# EAGLE schematic OBI_SlaveBoard_rev4 (EAGLE 7.2.0)
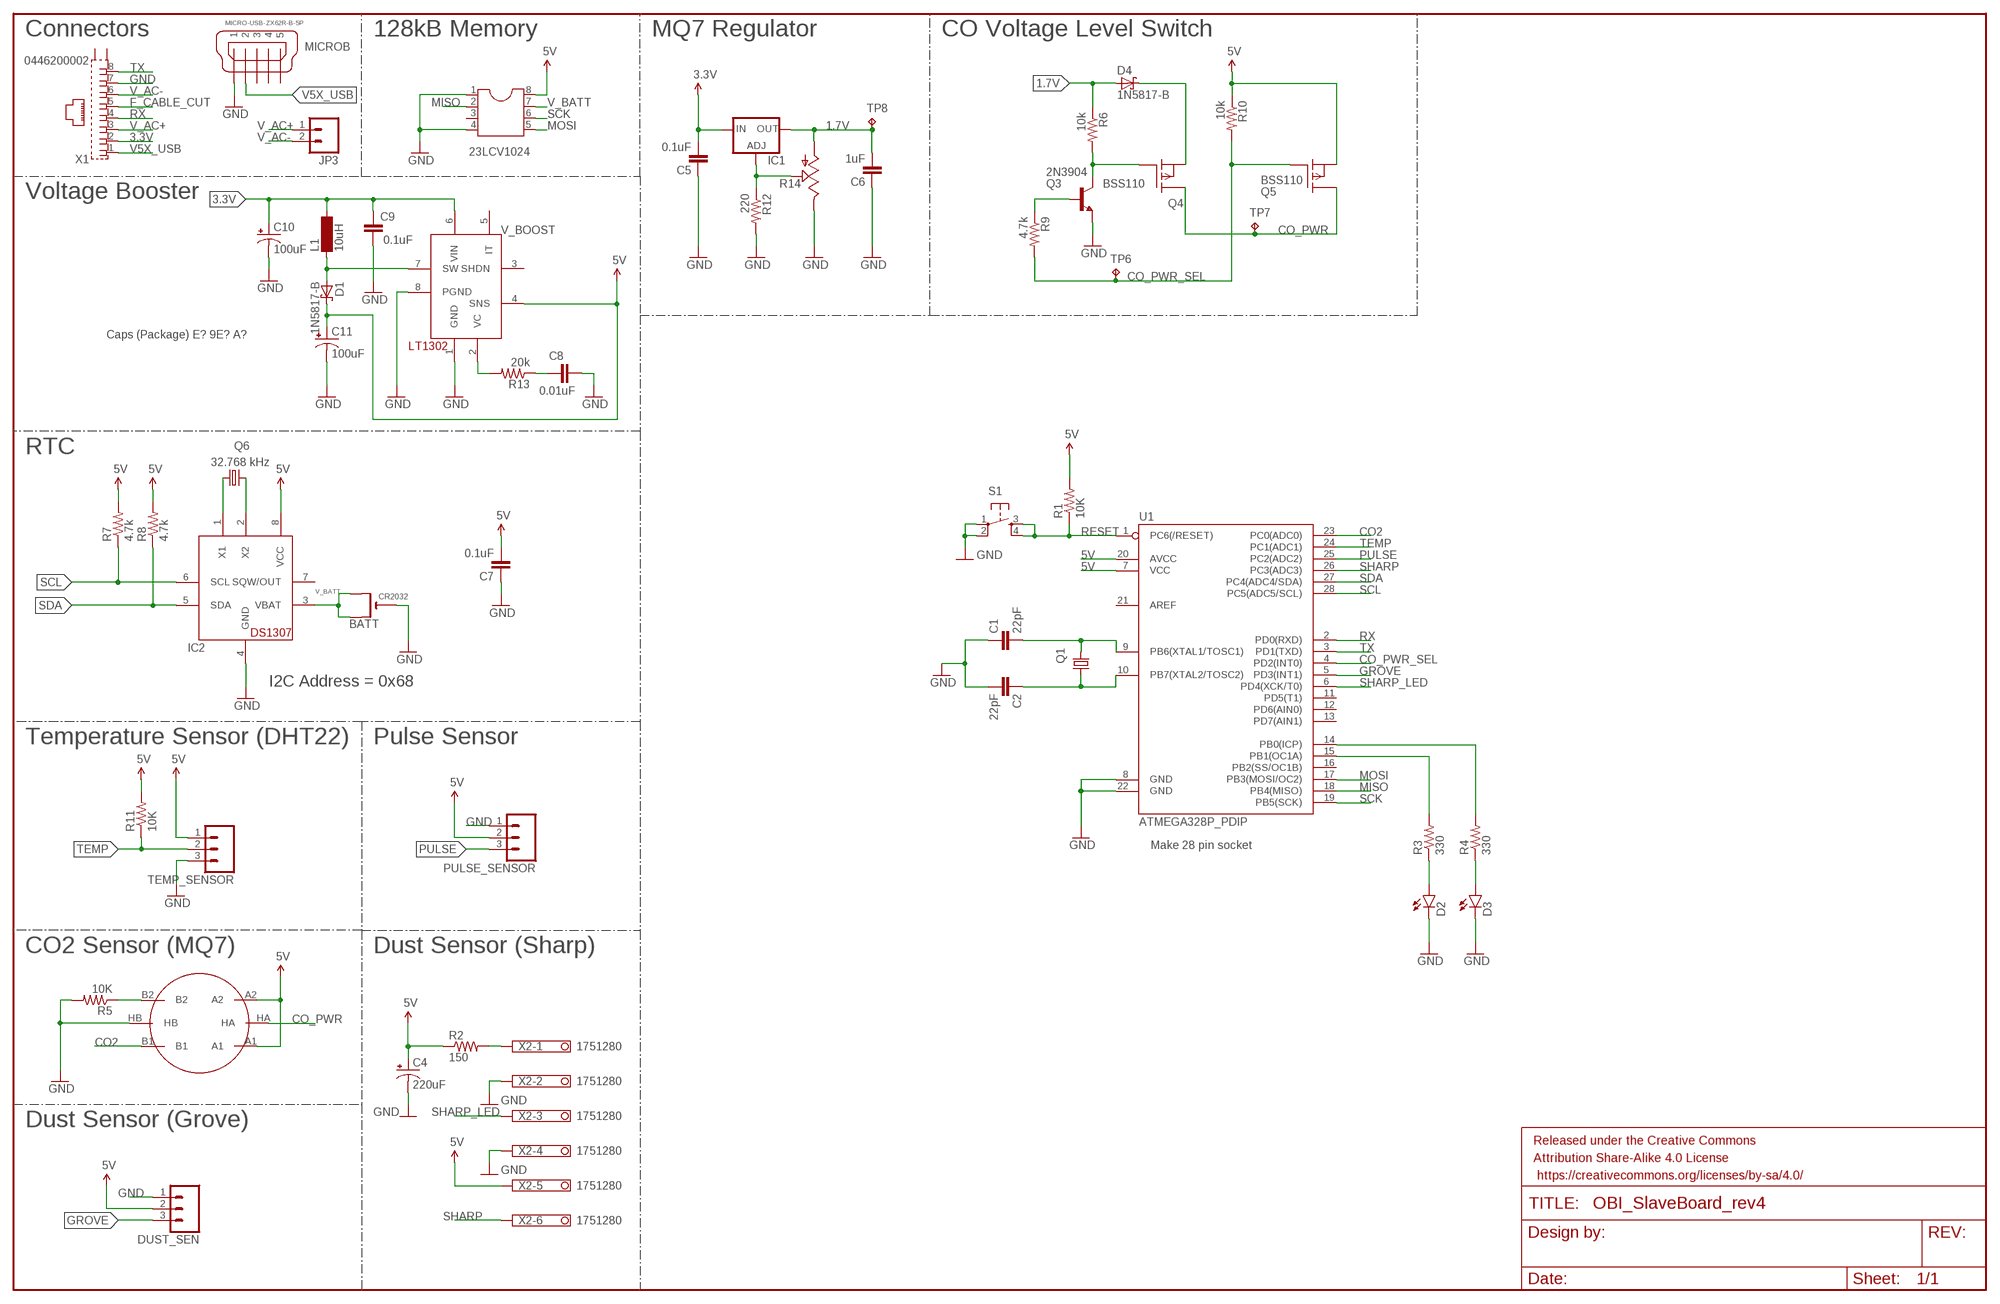
[diagram p0: schematic, sheet 1]

## Parts
23LCV1024  DIL8S  [SOCKET-08]
BATT  CR2032THM  [CR2032-THRU]
C1  22pF  CAPKIT  [CAP-PTH-SMALL-KIT]
C2  22pF  CAPKIT  [CAP-PTH-SMALL-KIT]
C4  220uF  CAP_POLPTH2  [CPOL-RADIAL-10UF-25V]
C5  0.1uF  CAPKIT  [CAP-PTH-SMALL-KIT]
C6  1uF  CAPKIT  [CAP-PTH-SMALL-KIT]
C7  0.1uF  CAPKIT  [CAP-PTH-SMALL-KIT]
C8  0.01uF  CAPKIT  [CAP-PTH-SMALL-KIT]
C9  0.1uF  CAPKIT  [CAP-PTH-SMALL-KIT]
C10  100uF  CPOL-USTT2D5  [TT2D5]
C11  100uF  CPOL-USTT2D5  [TT2D5]
CO2_SENSOR  METHANE_SENSOR  [MQ-3]
D1  1N5817-B  SCHOTTKY-DIODEDO41  [DO41-10]
D2  LED5MM  [LED5MM]
D3  LED5MM  [LED5MM]
D4  1N5817-B  SCHOTTKY-DIODEDO41  [DO41-10]
DUST_SEN  M03SCREW  [SCREWTERMINAL-3.5MM-3]
FRAME1  FRAME-LEDGER  [CREATIVE_COMMONS]
IC1  LM317TS  [317TS]
IC2  DS1307  [DIL08]
JP3  M023.5MM  [SCREWTERMINAL-3.5MM-2]
L1  10uH  BS11  [BS11]
MICROB  MICRO-USB-ZX62R-B-5P  [ZX62R-B-5P]
PULSE_SENSOR  M03SCREW  [SCREWTERMINAL-3.5MM-3]
Q1  CRYSTALHC49S  [HC49/S]
Q3  2N3904  TRANSISTOR_NPN2N3904  [TO-92]
Q4  BSS110  [TO92]
Q5  BSS110  [TO92]
Q6  32.768 kHz  CRYSTALTC26V  [TC26V]
R1  10K  RESISTORPTH-1/4W  [AXIAL-0.4]
R2  150  RESISTORPTH-1/4W  [AXIAL-0.4]
R3  330  RESISTORPTH-1/4W  [AXIAL-0.4]
R4  330  RESISTORPTH-1/4W  [AXIAL-0.4]
R5  10K  RESISTORPTH-1/4W  [AXIAL-0.4]
R6  10k  RESISTORPTH-1/4W  [AXIAL-0.4]
R7  4.7k  RESISTORPTH-1/4W  [AXIAL-0.4]
R8  4.7k  RESISTORPTH-1/4W  [AXIAL-0.4]
R9  4.7k  RESISTORPTH-1/4W  [AXIAL-0.4]
R10  10k  RESISTORPTH-1/4W  [AXIAL-0.4]
R11  10K  RESISTORPTH-1/4W  [AXIAL-0.4]
R12  220  RESISTORPTH-1/4W  [AXIAL-0.4]
R13  20k  RESISTORPTH-1/4W  [AXIAL-0.4]
R14  TRIM_US-CT6  [CT6]
S1  TAC_SWITCHPTH  [TACTILE-PTH]
TEMP_SENSOR  M03SCREW  [SCREWTERMINAL-3.5MM-3]
TP6  TPPAD1-13  [P1-13]
TP7  TPPAD1-13  [P1-13]
TP8  TPPAD1-13  [P1-13]
U1  ATMEGA328P_PDIP  [DIL28-3]
V_BOOST  LT1302  [DIL08]
X1  0446200002  [0446200002]
X2  1751280  [1751280]

## Nets
1.7V: C6.2 D4.A IC1.2(OUT) R6.P$1 R14.A TP8.TP
3.3V: C5.2 C9.1 C10.+ IC1.3(IN) L1.2 V_BOOST.6(VIN) X1.2
5V: 23LCV1024.8 C4.1(+) C7.2 C11.+ CO2_SENSOR.A1 CO2_SENSOR.A2 D1.C DUST_SEN.2 IC2.8(VCC) PULSE_SENSOR.2 Q5.1(S) R1.P$2 R2.P$1 R7.P$2 R8.P$2 R10.P$1 R11.P$2 TEMP_SENSOR.1 U1.7(VCC) U1.20(AVCC) V_BOOST.4(SNS) X2.5
CO2: CO2_SENSOR.B1 U1.23(PC0(ADC0))
CO_PWR: CO2_SENSOR.HA Q4.3(D) Q5.3(D) TP7.TP
CO_PWR_SEL: Q5.2(G) R9.P$2 R10.P$2 TP6.TP U1.4(PD2(INT0))
F_CABLE_CUT: X1.5
GND: 23LCV1024.1 23LCV1024.4 BATT.- C1.1 C2.2 C4.2(-) C5.1 C6.1 C7.1 C8.1 C9.2 C10.- C11.- CO2_SENSOR.HB D2.K(C) D3.K(C) DUST_SEN.1 IC2.4(GND) MICROB.1 PULSE_SENSOR.1 Q3.1(E) R5.P$2 R12.P$2 R14.E S1.1 S1.2 TEMP_SENSOR.3 U1.8(GND) U1.22(GND) V_BOOST.1(GND) V_BOOST.8(PGND) X1.7 X2.2 X2.4
GROVE: DUST_SEN.3 U1.5(PD3(INT1))
MISO: 23LCV1024.2 U1.18(PB4(MISO))
MOSI: 23LCV1024.5 U1.17(PB3(MOSI/OC2))
N$1: IC2.1(X1) Q6.1
N$2: Q3.3(C) Q4.2(G) R6.P$2
N$3: C1.2 Q1.2 U1.9(PB6(XTAL1/TOSC1))
N$4: Q3.2(B) R9.P$1
N$5: C2.1 Q1.1 U1.10(PB7(XTAL2/TOSC2))
N$6: IC2.2(X2) Q6.2
N$8: R2.P$2 X2.1
N$9: IC1.1(ADJ) R12.P$1 R14.S
N$10: R3.P$2 U1.15(PB1(OC1A))
N$11: D2.A R3.P$1
N$12: R4.P$2 U1.14(PB0(ICP))
N$13: D3.A R4.P$1
N$14: R13.P$2 V_BOOST.2(VC)
N$15: D4.C Q4.1(S)
N$17: CO2_SENSOR.B2 R5.P$1
N$18: C8.2 R13.P$1
N$22: D1.A L1.1 V_BOOST.7(SW)
PULSE: PULSE_SENSOR.3 U1.25(PC2(ADC2))
RESET: R1.P$1 S1.3 S1.4 U1.1(PC6(/RESET))
RX: U1.2(PD0(RXD)) X1.4
SCK: 23LCV1024.6 U1.19(PB5(SCK))
SCL: IC2.6(SCL) R7.P$1 U1.28(PC5(ADC5/SCL))
SDA: IC2.5(SDA) R8.P$1 U1.27(PC4(ADC4/SDA))
SHARP: U1.26(PC3(ADC3)) X2.6
SHARP_LED: U1.6(PD4(XCK/T0)) X2.3
TEMP: R11.P$1 TEMP_SENSOR.2 U1.24(PC1(ADC1))
TX: U1.3(PD1(TXD)) X1.8
V5X_USB: MICROB.2 X1.1
V_AC+: JP3.1 X1.3
V_AC-: JP3.2 X1.6
V_BATT: 23LCV1024.7 BATT.+1(+) BATT.+2(+1) IC2.3(VBAT)
Unconnected: 23LCV1024.3 IC2.7(SQW/OUT) MICROB.3 MICROB.4 MICROB.5 U1.11(PD5(T1)) U1.12(PD6(AIN0)) U1.13(PD7(AIN1)) U1.16(PB2(SS/OC1B)) U1.21(AREF) V_BOOST.3(SHDN) V_BOOST.5(IT) X1.S@1(S1) X1.S@2(S2)

## Notes on the sheet
- Connectors | 128kB Memory | MQ7 Regulator | CO Voltage Level Switch
- Voltage Booster
- Caps (Package) E? 9E? A?
- RTC
- I2C Address = 0x68
- Temperature Sensor (DHT22) | Pulse Sensor
- Make 28 pin socket
- CO2 Sensor (MQ7) | Dust Sensor (Sharp)
- Dust Sensor (Grove)

## Library data of the parts
23LCV1024 = ic-package:DIL8: Dual In Line / Socket
BATT = adafruit:CR2032
C1 C2 C5-C9 = SparkFun-Passives:CAP: Capacitor Standard 0603 ceramic capacitor, and 0.1" leaded capacitor.
C4 = SparkFun-Capacitors:CAP_POL: Capacitor Polarized These are standard SMD and PTH capacitors. Normally 10uF, 47uF, and 100uF in electrolytic and tantalum varieties. Always verify the external diameter of the through hole cap, it varies with capacity, voltage, and manufacturer. The EIA devices should be standard.
C10 C11 = rcl:CPOL-US: POLARIZED CAPACITOR, American symbol
CO2_SENSOR = SparkFun-Sensors:METHANE_SENSOR: MQ-4 Methane Gas Sensor SEN-09404
D1 D4 = adafruit:SCHOTTKY-DIODE: Schottky Diode
D2 D3 = SparkFun-LED:LED: LEDs Standard schematic elements and footprints for 5mm, 3mm, 1206, and 0603 sized LEDs. 5mm - Spark Fun Electronics SKU : COM-00529 (and others)
DUST_SEN PULSE_SENSOR TEMP_SENSOR = SparkFun-Connectors:M03: Header 3 Standard 3-pin 0.1" header. Use with straight break away headers (SKU : PRT-00116), right angle break away headers (PRT-00553), swiss pins (PRT-00743), machine pins (PRT-00117), and female headers (PRT-00115). Molex polarized connector foot print use with SKU : PRT-08232 with associated crimp pins and housings.
FRAME1 = SparkFun-Aesthetics:FRAME-LEDGER: Schematic Frame Standard 11x14 US Ledger frame
IC1 = v-reg:LM317TS: VOLTAGE REGULATOR
IC2 = adafruit:DS1307: DS1307 Real time clock (RTC) with battery backup ability. Talk to it via i2c
JP3 = SparkFun-Connectors:M02: Standard 2-pin 0.1" header. Use with - straight break away headers ( PRT-00116) - right angle break away headers (PRT-00553) - swiss pins (PRT-00743) - machine pins (PRT-00117) - female headers (PRT-00115) Molex polarized connector foot print use with: PRT-08233 with associated crimp pins and housings. 2.54_SCREWTERM for use with PRT-10571. 3.5mm Screw Terminal footprints for PRT-08084 5mm Screw Terminal footprints for use with PRT-08432; PROD_ID: CONN-08399
L1 = inductor-neosid:BS: INDUCTOR nominal inductance, magnetically screened; OC_FARNELL: unknown; OC_NEWARK: unknown
MICROB = con-hirose:MICRO-USB-: Hirose Micro USB Connector ZX62R-B-5P: Micro B, reverse (top mount) shell SMT Supplier: DigiKey H11574CT-ND Source: http://www.hirose.co.jp/cataloge_hp/e24200011.pdf
Q1 = crystal:CRYSTAL: CRYSTAL; OC_FARNELL: 1667008; OC_NEWARK: unknown
Q3 = SparkFun-DiscreteSemi:TRANSISTOR_NPN: Generic NPN BJT MMBT2222A - TRANS-08049 (SOT-23, 1A 40V) MPSA42 - TRANS-09116 (SOT-23, 500mA 300V) MMBT5088LT1G - TRANS-11160 (SOT-23, 50 mA 30V) BC547 - COM-08928 <http://www.sparkfun.com/products/8928> (TO-92 45V 100mA) (1.Collector 2.Base 3.Emitter) 2N3904 - COM-00521 <http://www.sparkfun.com/products/521> (TO-92 40V 200mA) (1.Emitter 2.Base 3.Collector) P2N2222A - COM-12852 <http://www.sparkfun.com/products/12852> (TO-92 40V 600mA) (1.Collector 2.Base 3.Emitter); PROD_ID: TRANS-08447
Q4 Q5 = transistor-fet:BSS110: P-Channel Enhancement MOSFET -50V; -0,17A; 6Ohm
Q6 = crystal:CRYSTAL: CRYSTAL; OC_FARNELL: unknown; OC_NEWARK: unknown
R1 R5 R7 R8 = SparkFun-Passives:RESISTOR: Resistor Basic schematic elements and footprints for 0603, 1206, and PTH resistors.
R2-R4 R6 R9-R13 = SparkFun-Resistors:RESISTOR: Resistor Basic schematic elements and footprints for 0603, 1206, and PTH resistors.
R14 = pot:TRIM_US-: POTENTIOMETER
S1 = SparkFun-Retired:TAC_SWITCH: Momentary Switch Button commonly used for reset or general input. Spark Fun Electronics SKU : COM-00097 SMT- SWCH-08247
TP6-TP8 = testpad:TP: Test pad
U1 = SparkFun-DigitalIC:ATMEGA328P_PDIP: uC used in the Arduino 32kb flash, 1k EEPROM, 2k SRAM This is the through-hole version of this chip.
V_BOOST = adafruit:LT1302
X1 = con-molex:0446200002: RJ-45 INVERTED MODULAR JACK ASSEMBLY WITH RJ-11 KEEPOUT FEATURE Source: Data sheet <http://www.farnell.com/datasheets/73207.pdf> MOLEX 0446200002 BUCHSE, RJ45, GESCHIRMT Source: Farnell <http://de.farnell.com/molex/0446200002/buchse-rj45-geschirmt/dp/9251910?ost=9251910>; MF: MOLEX; MPN: 0446200002; OC_FARNELL: 9251910
X2 = con-phoenix-350:1751280: MKDS 1/ 6-3,5 Printklemme Nennstrom: 10 A Bemessungsspannung: 160 V Raster: 3,5 mm Polzahl: 6 Montageart: Löten Anschlussart: Schraubanschluss Anschlussrichtung vom Leiter zur Platine: 0° Source: http://eshop.phoenixcontact.com .. 1751280.pdf; MPN: 1751280; OC_FARNELL: unknown; OC_NEWARK: 27R1765